# Altium schematic sheet [05] - AUDIO.SchDoc: Project
size A4; Organization: Tor Brodtkorb; Address1: Frode Rinnans veg 193; Address2: 7050 Trondheim; DocumentNumber: 6598; Revision: 1.0; SheetNumber: 1; SheetTotal: 1
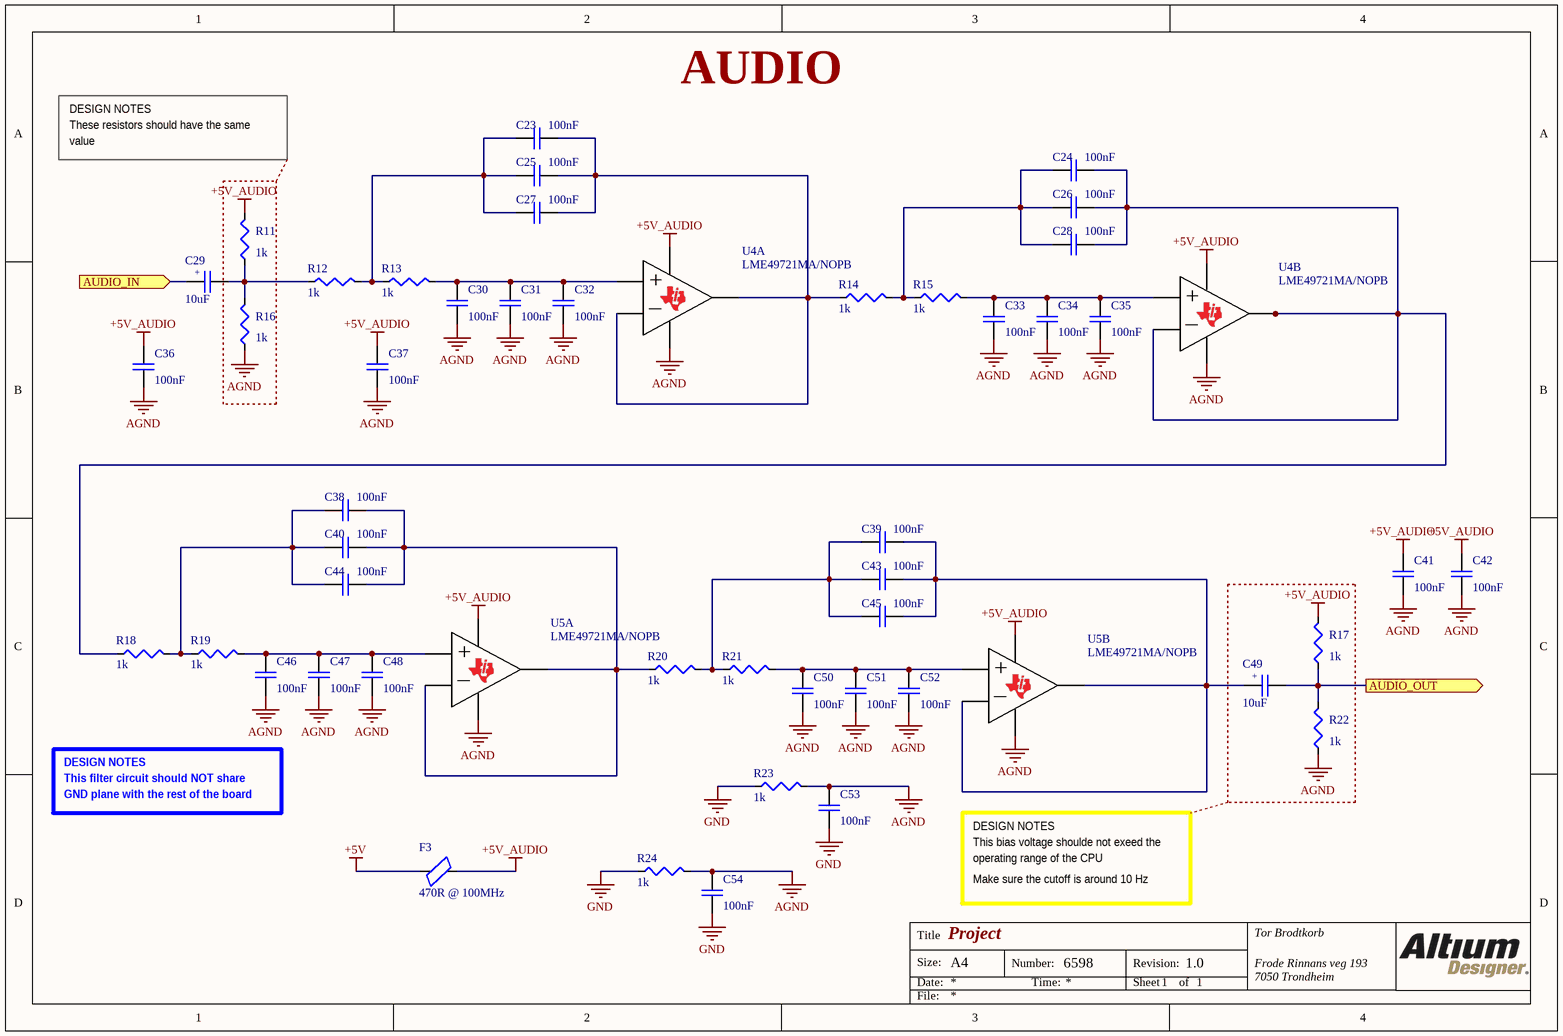
[diagram p0: [05] - AUDIO.SchDoc]

## Parts
C23  value 100nF  [C0603]  (hidden comment: 02016D104KAT2A)
C24  value 100nF  [C0603]  (hidden comment: 02016D104KAT2A)
C25  value 100nF  [C0603]  (hidden comment: 02016D104KAT2A)
C26  value 100nF  [C0603]  (hidden comment: 02016D104KAT2A)
C27  value 100nF  [C0603]  (hidden comment: 02016D104KAT2A)
C28  value 100nF  [C0603]  (hidden comment: 02016D104KAT2A)
C29  value 10uF  [Capacitor electrolytic SMD 4x5.4]  (hidden comment: EEE1HA2R2SR)
C30  value 100nF  [C0603]  (hidden comment: 02016D104KAT2A)
C31  value 100nF  [C0603]  (hidden comment: 02016D104KAT2A)
C32  value 100nF  [C0603]  (hidden comment: 02016D104KAT2A)
C33  value 100nF  [C0603]  (hidden comment: 02016D104KAT2A)
C34  value 100nF  [C0603]  (hidden comment: 02016D104KAT2A)
C35  value 100nF  [C0603]  (hidden comment: 02016D104KAT2A)
C36  value 100nF  [C0603]  (hidden comment: 02016D104KAT2A)
C37  value 100nF  [C0603]  (hidden comment: 02016D104KAT2A)
C38  value 100nF  [C0603]  (hidden comment: 02016D104KAT2A)
C39  value 100nF  [C0603]  (hidden comment: 02016D104KAT2A)
C40  value 100nF  [C0603]  (hidden comment: 02016D104KAT2A)
C41  value 100nF  [C0603]  (hidden comment: 02016D104KAT2A)
C42  value 100nF  [C0603]  (hidden comment: 02016D104KAT2A)
C43  value 100nF  [C0603]  (hidden comment: 02016D104KAT2A)
C44  value 100nF  [C0603]  (hidden comment: 02016D104KAT2A)
C45  value 100nF  [C0603]  (hidden comment: 02016D104KAT2A)
C46  value 100nF  [C0603]  (hidden comment: 02016D104KAT2A)
C47  value 100nF  [C0603]  (hidden comment: 02016D104KAT2A)
C48  value 100nF  [C0603]  (hidden comment: 02016D104KAT2A)
C49  value 10uF  [Capacitor electrolytic SMD 4x5.4]  (hidden comment: EEE1HA2R2SR)
C50  value 100nF  [C0603]  (hidden comment: 02016D104KAT2A)
C51  value 100nF  [C0603]  (hidden comment: 02016D104KAT2A)
C52  value 100nF  [C0603]  (hidden comment: 02016D104KAT2A)
C53  value 100nF  [C0603]  (hidden comment: 02016D104KAT2A)
C54  value 100nF  [C0603]  (hidden comment: 02016D104KAT2A)
F3  value 470R @ 100MHz  [Ferrite bead 0603]  (hidden comment: BLM18AG121SN1D)
R11  value 1k  [R0603]  (hidden comment: CPF-A-0603B100KE1)
R12  value 1k  [R0603]  (hidden comment: CPF-A-0603B100KE1)
R13  value 1k  [R0603]  (hidden comment: CPF-A-0603B100KE1)
R14  value 1k  [R0603]  (hidden comment: CPF-A-0603B100KE1)
R15  value 1k  [R0603]  (hidden comment: CPF-A-0603B100KE1)
R16  value 1k  [R0603]  (hidden comment: CPF-A-0603B100KE1)
R17  value 1k  [R0603]  (hidden comment: CPF-A-0603B100KE1)
R18  value 1k  [R0603]  (hidden comment: CPF-A-0603B100KE1)
R19  value 1k  [R0603]  (hidden comment: CPF-A-0603B100KE1)
R20  value 1k  [R0603]  (hidden comment: CPF-A-0603B100KE1)
R21  value 1k  [R0603]  (hidden comment: CPF-A-0603B100KE1)
R22  value 1k  [R0603]  (hidden comment: CPF-A-0603B100KE1)
R23  value 1k  [R0603]  (hidden comment: CPF-A-0603B100KE1)
R24  value 1k  [R0603]  (hidden comment: CPF-A-0603B100KE1)
U4  LME49721MA/NOPB  [LME49721MA/NOPB]  (parts A,B of 2)
U5  LME49721MA/NOPB  [LME49721MA/NOPB]  (parts A,B of 2)

## Ports
AUDIO_IN (in), AUDIO_OUT (out)

## Nets
+5V: F3.1
+5V_AUDIO: C36.2 C37.2 C41.2 C42.2 F3.2 R11.2 R17.2 U4.8(VDD) U5.8(VDD)
AGND: C30.1 C31.1 C32.1 C33.1 C34.1 C35.1 C36.1 C37.1 C41.1 C42.1 C46.1 C47.1 C48.1 C50.1 C51.1 C52.1 C53.2 C54.2 R16.1 R22.1 R23.2 R24.2 U4.4(VDD) U5.4(VDD)
GND: C53.1 C54.1 R23.1 R24.1
AUDIO_IN: C29.1 ; port AUDIO_IN
AUDIO_OUT: C49.2 R17.1 R22.2 ; port AUDIO_OUT
NetC23_1: C23.1 C25.1 C27.1 R12.2 R13.1
NetC23_2: C23.2 C25.2 C27.2 R14.1 U4.1(VDD) U4.2(VDD)
NetC24_1: C24.1 C26.1 C28.1 R14.2 R15.1
NetC24_2: C24.2 C26.2 C28.2 R18.1 U4.6(VDD) U4.7(VDD)
NetC29_2: C29.2 R11.1 R12.1 R16.2
NetC30_2: C30.2 C31.2 C32.2 R13.2 U4.3(VDD)
NetC33_2: C33.2 C34.2 C35.2 R15.2 U4.5(VDD)
NetC38_1: C38.1 C40.1 C44.1 R18.2 R19.1
NetC38_2: C38.2 C40.2 C44.2 R20.1 U5.1(VDD) U5.2(VDD)
NetC39_1: C39.1 C43.1 C45.1 R20.2 R21.1
NetC39_2: C39.2 C43.2 C45.2 C49.1 U5.6(VDD) U5.7(VDD)
NetC46_2: C46.2 C47.2 C48.2 R19.2 U5.3(VDD)
NetC50_2: C50.2 C51.2 C52.2 R21.2 U5.5(VDD)

## Notes on the sheet
- DESIGN NOTES
- AUDIO
- These resistors should have the same
- value
- This filter circuit should NOT share
- GND plane with the rest of the board
- This bias voltage shoulde not exeed the
- operating range of the CPU
- Make sure the cutoff is around 10 Hz
- Title
- Size:
- Date:
- A4
- Number:
- Time:
- Revision:
- Sheet
- of
- File:
- (in symbol EEE1HA2R2SR) +
- (in symbol LME49721MA/NOPB, part A) +; _
- (in symbol LME49721MA/NOPB, part B) +; _

## Library data of the parts
C23-C28 C30-C48 C50-C54 = 02016D104KAT2A: C0603
C29 C49 = EEE1HA2R2SR: El. Capacitor SMD 4x5.4
F3 = BLM18AG121SN1D: Ferrite bead 0603
R11-R24 = CPF-A-0603B100KE1: R0603
U4 U5 = LME49721MA/NOPB: Audio OP amp, single supply, low voltage